# Altium schematic sheet Lauren schematic.SchDoc
size B; SheetNumber: 1; SheetTotal: 3
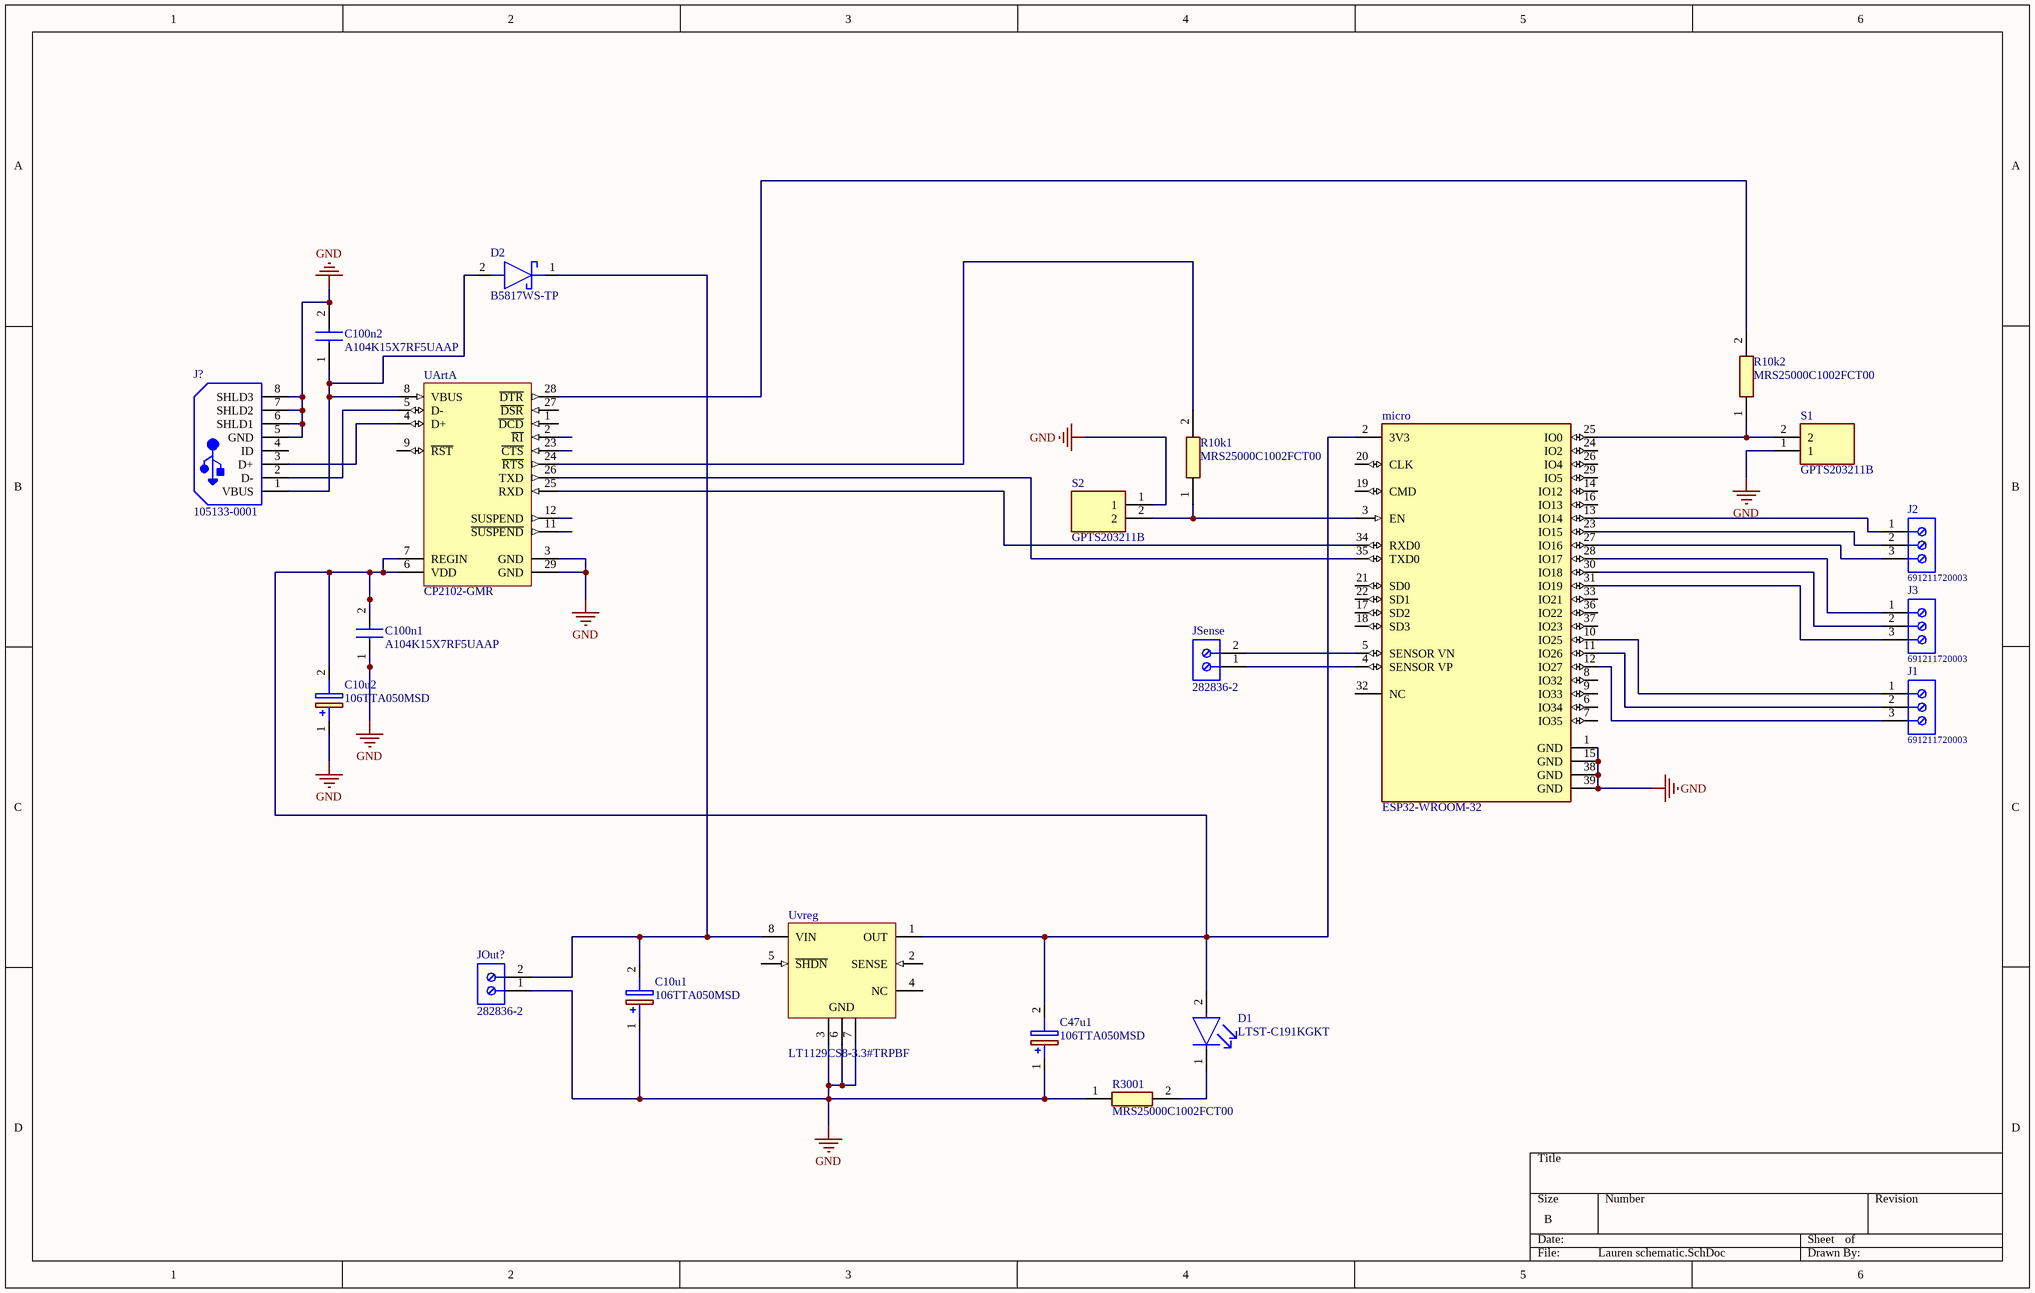
[diagram p0: Lauren schematic.SchDoc]

## Parts
C10u1  106TTA050MSD  [CAPPA3600W50L1500D525]
C10u2  106TTA050MSD  [CAPPA3600W50L1500D525]
C47u1  106TTA050MSD  [CAPPA3600W50L1500D525]
C100n1  A104K15X7RF5UAAP  [CAPPA1420W55L380D260]
C100n2  A104K15X7RF5UAAP  [CAPPA1420W55L380D260]
D1  LTST-C191KGKT  [FP-LTST-C191KGKT-MFG]
D2  B5817WS-TP  [SOD2512X115N]
J1  691211720003  [691211720003]
J2  691211720003  [691211720003]
J3  691211720003  [691211720003]
J?  105133-0001  [MOLX-105133-0001_V]
JOut?  282836-2  [TECO-282836-2_V]
JSense  282836-2  [TECO-282836-2_V]
micro  ESP32-WROOM-32  [FP-ESP32-WROOM-32-MFG]
R10k1  MRS25000C1002FCT00  [RESAD1650W60L650D250]
R10k2  MRS25000C1002FCT00  [RESAD1650W60L650D250]
R3001  MRS25000C1002FCT00  [RESAD1650W60L650D250]
S1  GPTS203211B  [GPTS203211B]
S2  GPTS203211B  [GPTS203211B]
UArt  CP2102-GMR  [SLAB-QFN-28-3125x3125TP_M]  (part A of 2)
Uvreg  LT1129CS8-3.3#TRPBF  [LT-S8-8_M]

## Nets
GND: C10u1.1(+) C10u2.1(+) C47u1.1(+) C100n1.1(+) C100n2.2(-) J?.5(GND) J?.6(SHLD1) J?.7(SHLD2) J?.8(SHLD3) JOut?.1 micro.1(GND) micro.15(GND) micro.38(GND) micro.39(GND) R3001.1 S1.1 S2.1 UArt.3(GND) UArt.29(GND) Uvreg.3(GND) Uvreg.6(GND) Uvreg.7(GND)
NetC10u1_2: C10u1.2(-) D2.1(K) JOut?.2 Uvreg.8(VIN)
NetC10u2_2: C10u2.2(-) C47u1.2(-) C100n1.2(-) D1.2(A) micro.2(3V3) UArt.6(VDD) UArt.7(REGIN) Uvreg.1(OUT)
NetC100n2_1: C100n2.1(+) D2.2(A) J?.1(VBUS) UArt.8(VBUS)
NetD1_1: D1.1(C) R3001.2
NetJ1_1: J1.1 micro.10(IO25)
NetJ1_2: J1.2 micro.11(IO26)
NetJ1_3: J1.3 micro.12(IO27)
NetJ2_1: J2.1 micro.13(IO14)
NetJ2_2: J2.2 micro.23(IO15)
NetJ2_3: J2.3 micro.27(IO16)
NetJ3_1: J3.1 micro.28(IO17)
NetJ3_2: J3.2 micro.30(IO18)
NetJ3_3: J3.3 micro.31(IO19)
NetJ?_2: J?.2(D-) UArt.5(D-)
NetJ?_3: J?.3(D+) UArt.4(D+)
NetJSense_1: JSense.1 micro.4(SENSOR_VP)
NetJSense_2: JSense.2 micro.5(SENSOR_VN)
Netmicro_3: micro.3(EN) R10k1.1 S2.2
Netmicro_25: micro.25(IO0) R10k2.1 S1.2
Netmicro_34: micro.34(RXD0) UArt.25(RXD)
Netmicro_35: micro.35(TXD0) UArt.26(TXD)
NetR10k1_2: R10k1.2 UArt.24(~{RTS})
NetR10k2_2: R10k2.2 UArt.28(~{DTR})

Not connected (* = marked no-connect by the designer): J? 4(ID); micro 6(IO34) 7(IO35) 8(IO32) 9(IO33) 14(IO12) 16(IO13) 17(SD2) 18(SD3) 19(CMD) 20(CLK) 21(SD0) 22(SD1) 24(IO2) 26(IO4) 29(IO5) 32(NC) 33(IO21) 36(IO22) 37(IO23); UArt 1(~{DCD}) 2(~{RI}) 9(~{RST}) 11(~{SUSPEND}) 12(SUSPEND) 23(~{CTS}) 27(~{DSR}); Uvreg 2(SENSE) 4(NC) 5(~{SHDN})

## Library data of the parts
C10u1 C10u2 C47u1 = 106TTA050MSD: Capacitor Polarised; Manufacturer_Name: Cornell Dubilier; Datasheet Link: https://www.mouser.co.uk/datasheet/2/88/TTA_series-552998.pdf; Manufacturer_Part_Number: 106TTA050MSD; Mouser Part Number: 598-106TTA050MSD; Mouser Price/Stock: https://www.mouser.com/Search/Refine.aspx?Keyword=598-106TTA050MSD; Arrow Part Number: 106TTA050MSD; Arrow Price/Stock: https://www.arrow.com/en/products/106tta050msd/illinois-capacitor?region=nac
C100n1 C100n2 = A104K15X7RF5UAAP: Capacitor; Manufacturer_Name: Vishay; Datasheet Link: https://www.vishay.com/docs/45249/apseries.pdf; Manufacturer_Part_Number: A104K15X7RF5UAAP; Mouser Part Number: 594-A104K15X7RF5UAAP; Mouser Price/Stock: https://www.mouser.co.uk/ProductDetail/Vishay-BC-Components/A104K15X7RF5UAAP?qs=DPoM0jnrROUJ7499VET5BQ%3D%3D
D1 = CMP-2000-05198-2: LED GREEN CLEAR SMD; Max Power Dissipation: 75mW; Forward Current: 30mA; Reverse Voltage: 5V; Lens Color: Colorless; Forward Voltage: 2V; Dominant Wavelength: 571nm; Number of LEDs: 1; Viewing Angle: 130°; Lens Style: Rectangular; Test Current: 20mA; Luminous Intensity: 35mcd; Wavelength: 574nm; Width: 0.8mm; Case Code (Imperial): 0603; Number of Pins: 2; Lead Free: Lead Free; Packaging: Tape and Reel; Package Quantity: 1; Min Operating Temperature: -55°C; Case/Package: 0603; Length: 1.6mm; Power Dissipation: 75mW; Depth: 0.8mm; Radiation Hardening: No; Mount: Surface Mount; Max Operating Temperature: 85°C; Color: Green; Power Rating: 75mW; Height: 0.55mm; Illumination Color: Green; Case Code (Metric): 1608; Lens Transparency: Clear; Number of Elements: 1
D2 = B5817WS-TP: Schottky Diode; Manufacturer_Name: Micro Commercial Components (MCC); Datasheet Link: https://www.mouser.co.uk/datasheet/2/258/B5817WS-B5819WS(SOD-323)-V2-1626103.pdf; Height: 1.15mm; Manufacturer_Part_Number: B5817WS-TP; Mouser Part Number: 833-B5817WS-TP; Mouser Price/Stock: https://www.mouser.co.uk/ProductDetail/Micro-Commercial-Components-MCC/B5817WS-TP?qs=SdqRYZZ9IxCAZAlW9BKhPg%3D%3D; Arrow Part Number: B5817WS-TP; Arrow Price/Stock: https://www.arrow.com/en/products/b5817ws-tp/micro-commercial-components?region=europe
J1-J3 = CMP-1502-02525-1: Serie 211 - 5.00 mm 45deg Entry Modular with Rising Cage Clamp - 15.50 mm Height WR-TBL, 3 pin; Manufacturer: Wurth Elektronik; Pitch: 5.00mm; Pin Number: 3; Packaging: Box; Operating Temperature: -40to105degC; Mounting Technology: THT; Publisher: WurthElektronik; Manufacturer URL: http://www.we-online.de; Part Number: 691211720003; Datasheet URL: http://katalog.we-online.de/em/datasheet/6912117200xx.pdf; Package Reference: 691211720003
J? = CMP-2000-05829-1: Micro-USB B Receptacle, Vertical, -30 to 85 degC, 5-Pin SMD, RoHS, Tape and Reel; Manufacturer: Molex; Package Version: Rev. C, 11/2015; Voltage Rating: 30VAC; Connector Type: MicroUSBTypeBReceptacle; Current Rating: 1.8A; Number of Ports: 1; Voltage - Max: 30V; Mounting Style: SMD/SMT; Packaging: Reel; Product: MicroUSBTypeBConnectors; Contact Plating: Gold; Flammability Rating: UL94V-0; Package Description: 5-Pin Surface Mount Device, Pitch 0.65 mm; Package Reference: 105133-0001; Contact Material: CopperAlloy; Mounting Angle: Vertical; RoHS: Details; Manufacturer URL: http://www.molex.com/; Factory Pack Quantity: 6000; PartNumber: 105133-0001; Standard: USB; Brand: Molex; Series: 105133; Product Category: USBConnectors; Termination Style: SolderTail; Gender: Receptacle; Package URL: http://www.molex.com/pdm_docs/sd/1051330001_sd.pdf; Datasheet Version: 03/2016; Color: Black; Datasheet URL: http://www.molex.com/webdocs/datasheets/pdf/en-us/1051330001_IO_CONNECTORS.pdf; Mounting Technology: SurfaceMount
JOut? JSense = CMP-1684-00017-1: Female Header, Pitch 5 mm, 1 x 2 Position, Height 10 mm, Tail Length 3.5 mm, Rohs, Bulk; Manufacturer: TE Connectivity; Wire Gauge: 16-30AWG; Product Training Modules: Wire-to-BoardEurostyleTerminalBlocks; Clamp Material - Plating: Brass-NickelPlated; Voltage: 300V; Mating Orientation: HorizontalwithBoard; Current: 13.5A; Pitch: 0.197"(5.00mm); Screw Thread: M3; 3D Model: 282836-2.pdf; Other Names: 5ULV-02B / A98076; Dynamic Catalog: BuchananSeries; Number of Levels: 1; Torque - Screw: 0.68Nm(6Lb-In); Featured Product: EurostyleTerminalBlockConnectors; Positions Per Level: 2; Wire Termination: Screw-RisingCageClamp; Datasheet URL: http://www.te.com.cn/commerce/DocumentDelivery/DDEController?Action=showdoc&DocId=Catalog+Section%7F1308389_EUROSTYLE_TERMINAL_BLOCKS%7F0607%7Fpdf%7FEnglish%7FENG_CS_1308389_EUROSTYLE_TERMINAL_BLOCKS_0607.pdf%7F282836-2; Color: Green; Family: TerminalBlocks-WiretoBoard; RoHS Information: 282836-2StatementofCompliance; Standard Package: 300; Contact Material - Plating: Brass-TinPlated; Manufacturer URL: http://www.te.com; Housing Material: Polyamide(PA66),Nylon6/6; Features: Interlocking(Side); Package Description: Female Header, Pitch 5 mm, 1 x 2 Position, Height 10 mm, Tail Length 3.5 mm; Mounting Type: ThroughHole; Package Reference: THD; Packaging: Bulk; Series: Buchanan; Category: Connectors,Interconnects; Screw Material - Plating: Brass-NickelPlated
micro = CMP-194065-000008-1: RX TXRX MOD WIFI SURFACE MOUNT; Frequency: 2.5GHz; Sensitivity: -98dBm; Operating Supply Voltage: 3.6V; Data Rate: 150Mbps; Weight: 0.088185oz; Package Quantity: 550; Min Operating Temperature: -40°C; Mount: Surface Mount; Max Operating Temperature: 85°C; Packaging: Cut Tape; Case/Package: SMD/SMT
R10k1 R10k2 R3001 = MRS25000C1002FCT00: Resistor; Manufacturer_Name: Vishay; Datasheet Link: http://www.vishay.com/docs/28724/mrs16m25.pdf; Manufacturer_Part_Number: MRS25000C1002FCT00; Mouser Part Number: 594-MRS25000C1002FCT; Mouser Price/Stock: https://www.mouser.co.uk/ProductDetail/Vishay-BC-Components/MRS25000C1002FCT00?qs=H30XFsNYD%2FEwip42ZXddDQ%3D%3D; Arrow Part Number: MRS25000C1002FCT00; Arrow Price/Stock: https://www.arrow.com/en/products/mrs25000c1002fct00/vishay?region=nac
S1 S2 = GPTS203211B: Switch; Manufacturer_Name: CW Industries; Datasheet Link: http://switches-connectors-custom.cwind.com/Asset/GPTS203211BR2.pdf; Manufacturer_Part_Number: GPTS203211B; Mouser Part Number: 629-GPTS203211B; Mouser Price/Stock: https://www.mouser.co.uk/ProductDetail/CW-Industries/GPTS203211B?qs=sajaCoHCXPR%252BmLwibobs6Q%3D%3D
UArt = CMP-2000-04924-1: Single-Chip USB to URAT Bridge, 3.3 V, -40 to 85 degC, 28-Pin QFN, RoHS, Tape and Reel; Manufacturer: Silicon Labs; Interface Circuit Standard 1: RS-232; Transmitter and Receiver FIFO Counter: No; Supply Current: 26mA; Operating Supply Voltage (Min): 3V; Operating Supply Voltage (Typ): 3.3V; Data Rate: 1000kbps; Operating Supply Voltage (Max): 3.6V; Number of Channels: 1; Package URL: http://www.silabs.com/Support%20Documents/TechnicalDocs/C8051T61x.pdf; Operating Temperature (Max): 85C; Datasheet URL: http://www.mouser.com/ds/2/368/CP2102-9-247052.pdf; Operating Temperature Classification: Industrial; Operating Temperature (Min): -40C; Package Description: 28-Pin Quad-Flat No-Leads Package, Body 5 x 5 mm, Pitch 0.5 mm; Manufacturer URL: http://www.silabs.com/; Rad Hardened: No; Package Reference: QFN-28; Pin Count: 28; Packaging: TapeandReel; Mounting: SurfaceMount; Package Type: QFNEP; Datasheet Version: Rev. 1.6, 12/2013
Uvreg = CMP-0476-01546-1: Micropower Low Dropout Regulator with Shutdown, 4.15 to 30 V Vin, 3.3 V Vout, 8-pin SOIC (S8-8), 0 to 125 degC, Pb-Free, Tape and Reel; Manufacturer: Linear Technology; Iout(mA): 700; Output Voltage: 3.3 V; Discrete Pass Element: no; PSRR(dB): 64; Dropout Voltage(V): 0.45; Shutdown Current(uA): 16; Vin Max(V): 30; Vin Min(V): 4.15; Isupply(mA): 0.05; Number of Outputs: 1; PackageReference: S8-8; Mounting Technology: Surface Mount; ComponentLink2Description: Datasheet; PackageDescription: 8-Pin Plastic Small Outline (Narrow .150 Inch), Body 4.9 x 3.9 mm, Pitch 1.27 mm; ComponentLink3URL: http://cds.linear.com/docs/en/packaging/05081610_G_SO8.pdf; PackageVersion: Rev. G, 03/2012; Packing: Tape and Reel; RoHS: TRUE; ComponentLink1Description: Manufacturer URL; ComponentLink1URL: http://www.linear.com/; ComponentLink2URL: http://cds.linear.com/docs/en/datasheet/112935ff.pdf; PartNumber: LT1129CS8-3.3#TRPBF; ComponentLink3Description: Package Specification; DatasheetVersion: Rev. F